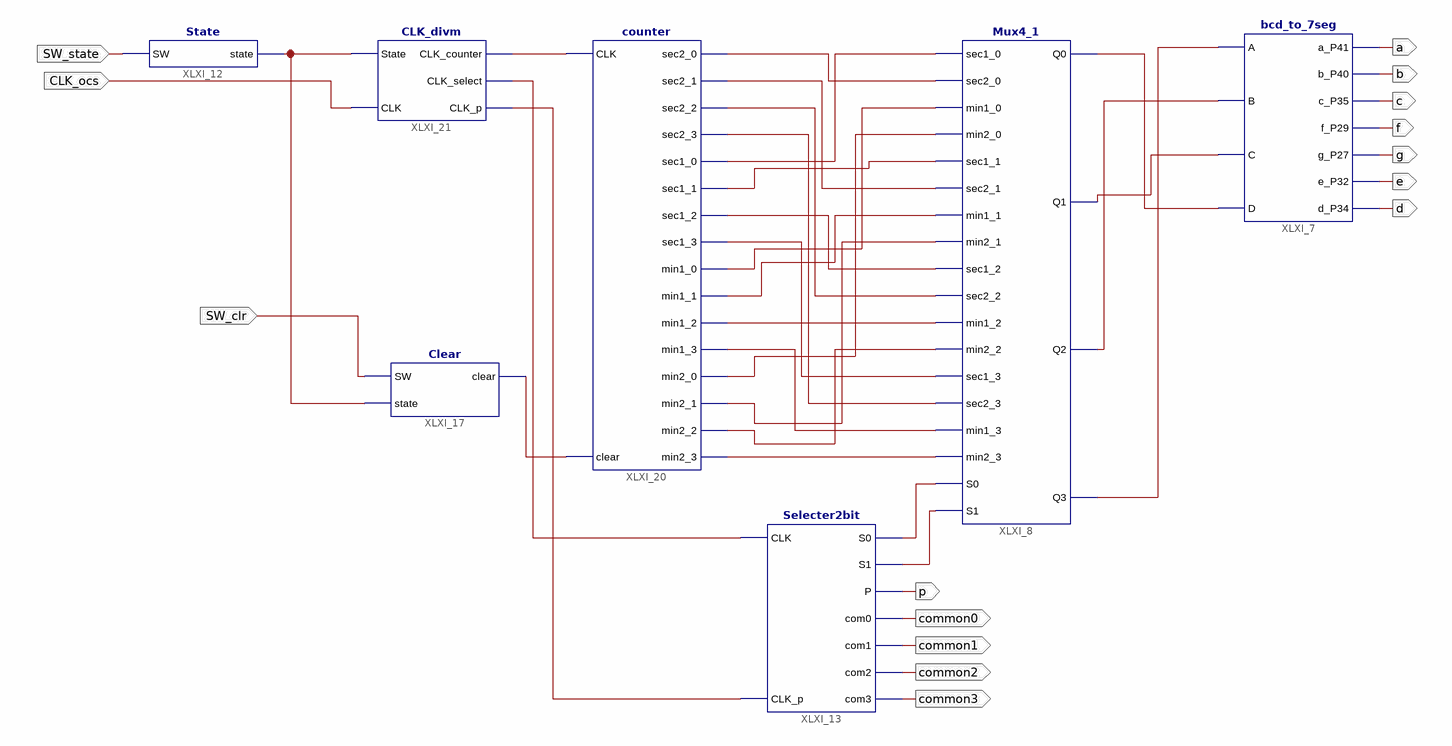
[diagram p0: schematic sheet 1]
// Xilinx ISE schematic main.sch (spartan6) as structural Verilog: 7 symbols, 15 ports
module main (
  input  SW_state,
  input  SW_clr,
  input  CLK_ocs,
  output a,
  output b,
  output c,
  output f,
  output g,
  output e,
  output d,
  output p,
  output common0,
  output common1,
  output common2,
  output common3
);

  wire XLXN_13, XLXN_14, XLXN_15, XLXN_16, XLXN_17, XLXN_18, XLXN_19, XLXN_20, XLXN_21, XLXN_22, XLXN_23,
       XLXN_24, XLXN_25, XLXN_26, XLXN_27, XLXN_28, XLXN_29, XLXN_30, XLXN_31, XLXN_33, XLXN_34, XLXN_35,
       XLXN_56, XLXN_60, XLXN_62, XLXN_65, XLXN_68;

  bcd_to_7seg XLXI_7 (
    .A(XLXN_33), .B(XLXN_31), .C(XLXN_30), .D(XLXN_29), .a_P41(a), .b_P40(b), .c_P35(c), .f_P29(f),
    .g_P27(g), .e_P32(e), .d_P34(d));
  Mux4_1 XLXI_8 (
    .sec1_0(XLXN_17), .sec2_0(XLXN_13), .min1_0(XLXN_21), .min2_0(XLXN_25), .sec1_1(XLXN_18),
    .sec2_1(XLXN_14), .min1_1(XLXN_22), .min2_1(XLXN_26), .sec1_2(XLXN_19), .sec2_2(XLXN_15),
    .min1_2(XLXN_23), .min2_2(XLXN_27), .sec1_3(XLXN_20), .sec2_3(XLXN_16), .min1_3(XLXN_24),
    .min2_3(XLXN_28), .S0(XLXN_34), .S1(XLXN_35), .Q0(XLXN_29), .Q1(XLXN_30), .Q2(XLXN_31), .Q3(XLXN_33));
  State XLXI_12 (.SW(SW_state), .state(XLXN_62));
  Selecter2bit XLXI_13 (
    .CLK(XLXN_56), .CLK_p(XLXN_68), .S0(XLXN_34), .S1(XLXN_35), .P(p), .com0(common0), .com1(common1),
    .com2(common2), .com3(common3));
  Clear XLXI_17 (.SW(SW_clr), .state(XLXN_62), .clear(XLXN_60));
  counter XLXI_20 (
    .CLK(XLXN_65), .clear(XLXN_60), .sec2_0(XLXN_13), .sec2_1(XLXN_14), .sec2_2(XLXN_15), .sec2_3(XLXN_16),
    .sec1_0(XLXN_17), .sec1_1(XLXN_18), .sec1_2(XLXN_19), .sec1_3(XLXN_20), .min1_0(XLXN_21),
    .min1_1(XLXN_22), .min1_2(XLXN_23), .min1_3(XLXN_24), .min2_0(XLXN_25), .min2_1(XLXN_26),
    .min2_2(XLXN_27), .min2_3(XLXN_28));
  CLK_divm XLXI_21 (.State(XLXN_62), .CLK(CLK_ocs), .CLK_counter(XLXN_65), .CLK_select(XLXN_56), .CLK_p(XLXN_68));

  // Notes on the sheet:
  //   LOC on signal SW_state = P51
  //   LOC on signal SW_clr = P48
  //   LOC on signal a = P41
  //   LOC on signal b = P40
  //   LOC on signal c = P35
  //   LOC on signal f = P29
  //   LOC on signal g = P27
  //   LOC on signal e = P32
  //   LOC on signal d = P34
  //   LOC on signal CLK_ocs = P123
  //   LOC on signal p = P26
  //   LOC on signal common0 = P44
  //   LOC on signal common1 = P43
  //   LOC on signal common2 = P33
  //   LOC on signal common3 = P30
endmodule
